# Altium schematic sheet LCD.SchDoc
size A4
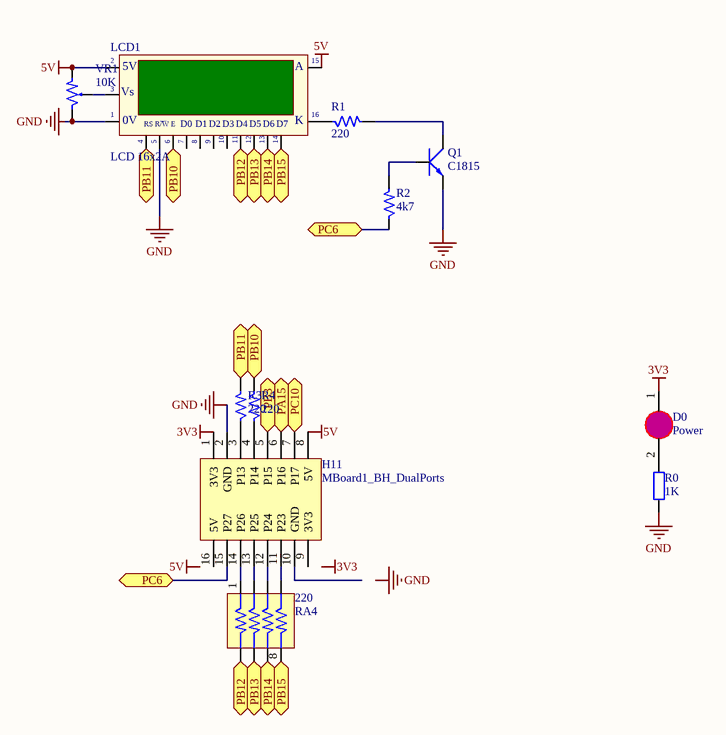
[diagram p0: LCD.SchDoc]

## Parts
220  RA4  [RA4]
D0  Power  [SMD0805]
H11  MBoard1_BH_DualPorts  [MBoard1_BH_DualPorts]
LCD1  LCD 16x2A  [LCD16X2]
Q1  C1815  [SOT23B]
R0  value 1K  [SMD0805R]  (hidden comment: R)
R1  220  [SMD0805R]
R2  4k7  [SMD0805R]
R3  220  [SMD0805R]
R4  220  [SMD0805R]
VR1  10K  [VR1]

## Ports
PA15, PB3, PB10, PB11, PB12, PB13, PB14, PB15, PC6, PC10

## Nets
3V3: D0.1(A) H11.1(3V3)
5V: H11.8(5V) LCD1.2(VDD) LCD1.15(A) VR1.1
GND: H11.2(GND) LCD1.1(GND) LCD1.5(R/~{W}) Q1.1(E) R0.1 VR1.3
PA15: H11.6(P16) ; port PA15
PB3: H11.5(P15) ; port PB3
PB10: LCD1.6(~{EN}) R4.2 ; port PB10
PB11: LCD1.4(RS) R3.2 ; port PB11
PB12: 220.2 LCD1.11(D4) ; port PB12
PB13: 220.4 LCD1.12(D5) ; port PB13
PB14: 220.6 LCD1.13(D6) ; port PB14
PB15: 220.8 LCD1.14(D7) ; port PB15
PC6: H11.15(P27) R2.1 ; port PC6
PC10: H11.7(P17) ; port PC10
Net220_1: 220.1 H11.14(P26)
Net220_3: 220.3 H11.13(P25)
Net220_5: 220.5 H11.12(P24)
Net220_7: 220.7 H11.11(P23)
NetD0_2: D0.2(K) R0.2
NetH11_3: H11.3(P13) R3.1
NetH11_4: H11.4(P14) R4.1
NetLCD1_3: LCD1.3(VEE) VR1.2
NetLCD1_16: LCD1.16(K) R1.1
NetQ1_2: Q1.2(C) R1.2
NetQ1_3: Q1.3(B) R2.2

Not connected (* = marked no-connect by the designer): H11 9(3V3) 10(GND) 16(5V); LCD1 7(D0) 8(D1) 9(D2) 10(D3)

## Notes on the sheet
- Labels drawn without touching a wire or pin: 3V3, 5V, GND
- (in symbol LCD16x2A) 5V; Vs; |; 0V; R/W; E

## Library data of the parts
D0 = LEDSMD: LED 3mm
LCD1 = LCD16x2A: LCD dipslay 16 char, 2 line; Value: LCD16x2A
Q1 = C1815: NPN 600mW, ECB; Value: C1815
R0 = R: RES_08; Published: 8-Jun-2000; LatestRevisionDate: 17-Jul-2002; LatestRevisionNote: Re-released for DXP Platform.; PackageReference: AXIAL-0.4; Publisher: Altium Limited
R1-R4 = R: Resistor 1/4W; Value: R1/4W - 1K
VR1 = VR1: Var Resistor; Value: VR 10K